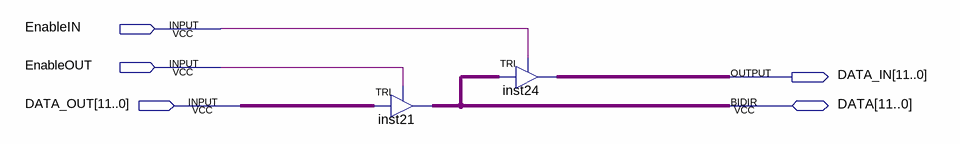
[diagram p0: schematic sheet]
// Quartus schematic Entrada_Salida.bdf as structural Verilog: 2 symbols, 5 pins
module Entrada_Salida (
  input  EnableIN,
  input  EnableOUT,
  input  [11:0] DATA_OUT,
  inout  [11:0] DATA,
  output [11:0] DATA_IN
);

  TRI inst21[11:0] (.IN(DATA_OUT), .OE(EnableOUT), .OUT(DATA));
  TRI inst24[11:0] (.IN(DATA), .OE(EnableIN), .OUT(DATA_IN));
endmodule
